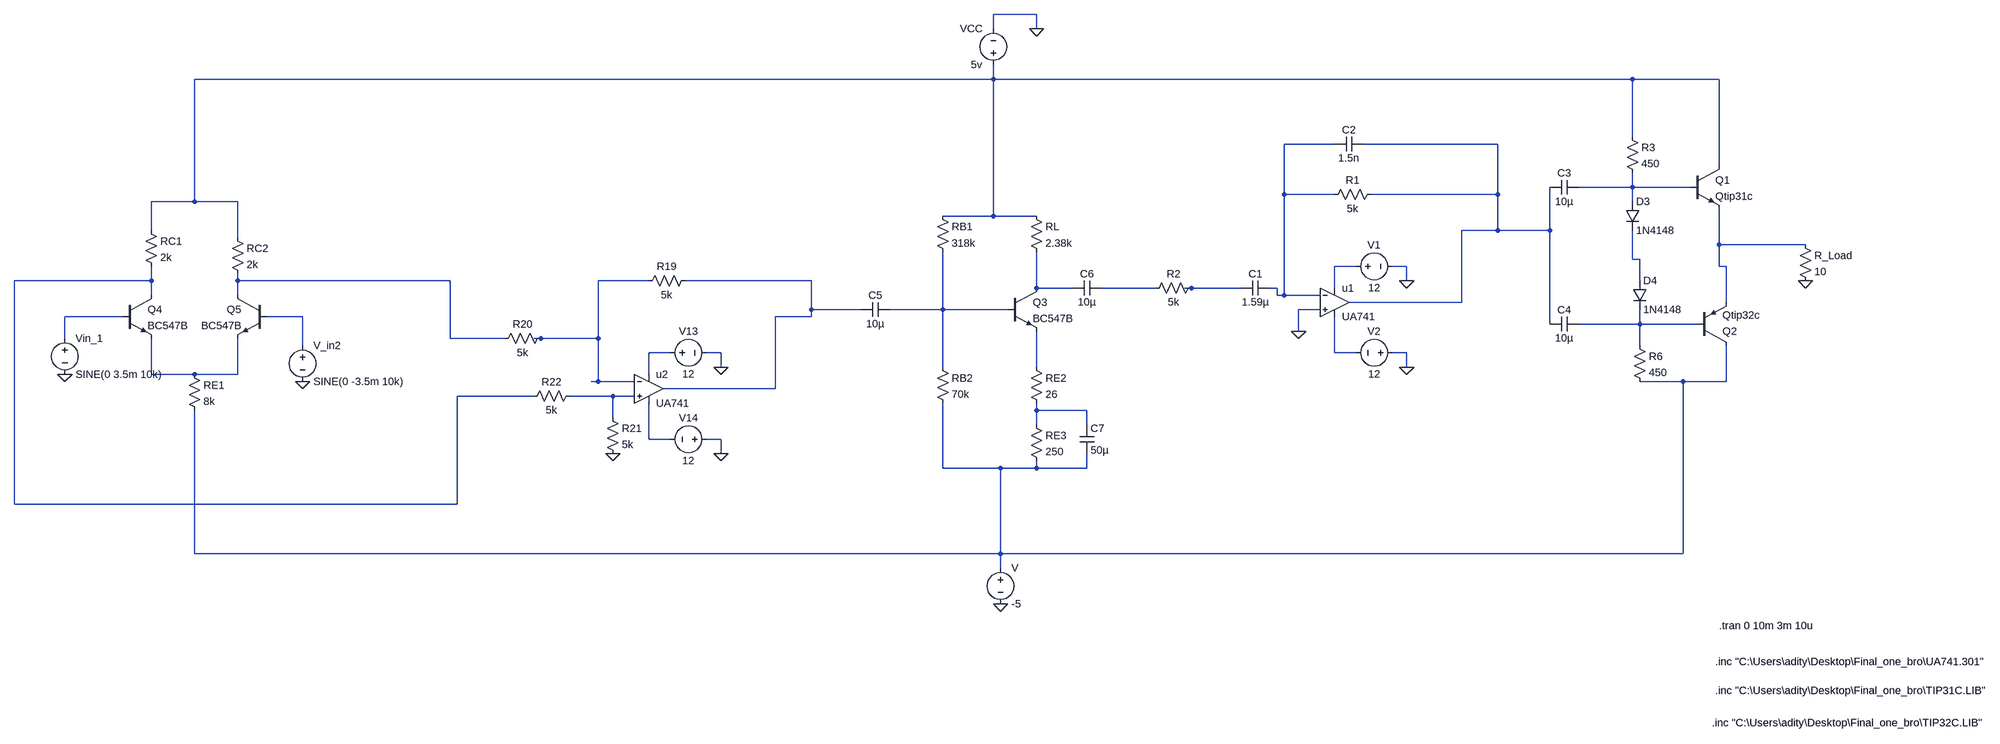
[diagram p0: schematic Project_1_Final.asc]
Project_1_Final.asc, the LTspice schematic file:
Version 4
SHEET 1 3136 1252
WIRE 288 -352 192 -352
WIRE 192 -320 192 -352
WIRE 288 -320 288 -352
WIRE 192 -208 192 -240
WIRE 192 -208 -1872 -208
WIRE 1920 -208 192 -208
WIRE 2112 -208 1920 -208
WIRE 1920 -80 1920 -208
WIRE 1040 -64 928 -64
WIRE 1504 -64 1104 -64
WIRE 2112 -16 2112 -208
WIRE 1920 32 1920 0
WIRE 1920 32 1792 32
WIRE 2048 32 1920 32
WIRE 928 48 928 -64
WIRE 1040 48 928 48
WIRE 1504 48 1504 -64
WIRE 1504 48 1120 48
WIRE -1872 64 -1872 -208
WIRE -1872 64 -1968 64
WIRE -1776 64 -1872 64
WIRE 1920 64 1920 32
WIRE 192 96 192 -208
WIRE 192 96 80 96
WIRE 288 96 192 96
WIRE -1968 128 -1968 64
WIRE 1504 128 1504 48
WIRE 1504 128 1424 128
WIRE 1728 128 1728 32
WIRE 1728 128 1504 128
WIRE -1776 144 -1776 64
WIRE 2112 160 2112 80
WIRE 2304 160 2112 160
WIRE 1920 192 1920 128
WIRE 1936 192 1920 192
WIRE 1088 208 1040 208
WIRE 1200 208 1168 208
WIRE 2112 208 2112 160
WIRE 2128 208 2112 208
WIRE -1968 240 -1968 208
WIRE -1968 240 -2272 240
WIRE -1776 240 -1776 224
WIRE -1248 240 -1776 240
WIRE -768 240 -880 240
WIRE -304 240 -688 240
WIRE 1200 240 1200 208
WIRE 1936 240 1936 192
WIRE 288 256 288 176
WIRE 368 256 288 256
WIRE 624 256 432 256
WIRE 704 256 688 256
WIRE 832 256 704 256
WIRE 912 256 896 256
WIRE 1040 256 1040 208
WIRE -1968 272 -1968 240
WIRE -1776 272 -1776 240
WIRE 912 272 912 256
WIRE 928 272 928 48
WIRE 928 272 912 272
WIRE 1008 272 928 272
WIRE 1424 288 1424 128
WIRE 1424 288 1072 288
WIRE 2128 288 2128 208
WIRE -304 304 -304 240
WIRE -112 304 -304 304
WIRE 80 304 80 176
WIRE 80 304 -48 304
WIRE 224 304 80 304
WIRE 1008 304 960 304
WIRE -2032 320 -2160 320
WIRE -1632 320 -1712 320
WIRE -304 320 -304 304
WIRE -304 320 -384 320
WIRE 1728 336 1728 128
WIRE 1936 336 1936 304
WIRE 1936 336 1792 336
WIRE 2064 336 1936 336
WIRE 960 352 960 304
WIRE -2160 368 -2160 320
WIRE -1248 368 -1248 240
WIRE -1088 368 -1248 368
WIRE -1008 368 -1024 368
WIRE -880 368 -880 240
WIRE -880 368 -1008 368
WIRE -1632 384 -1632 320
WIRE 1936 384 1936 336
WIRE -720 400 -768 400
WIRE -608 400 -640 400
WIRE 1040 400 1040 320
WIRE 1088 400 1040 400
WIRE 1200 400 1168 400
WIRE -608 432 -608 400
WIRE 80 432 80 304
WIRE 288 432 288 352
WIRE 1200 432 1200 400
WIRE -1968 448 -1968 368
WIRE -1872 448 -1968 448
WIRE -1776 448 -1776 368
WIRE -1776 448 -1872 448
WIRE -768 448 -768 400
WIRE -880 464 -880 368
WIRE -880 464 -896 464
WIRE -800 464 -880 464
WIRE 2032 464 1936 464
WIRE 2128 464 2128 384
WIRE 2128 464 2032 464
WIRE -384 480 -384 320
WIRE -384 480 -736 480
WIRE -1024 496 -1232 496
WIRE -848 496 -944 496
WIRE -800 496 -848 496
WIRE 288 528 288 512
WIRE 400 528 288 528
WIRE -848 544 -848 496
WIRE 288 560 288 528
WIRE 400 560 400 528
WIRE -768 592 -768 512
WIRE -720 592 -768 592
WIRE -608 592 -640 592
WIRE -608 624 -608 592
WIRE 80 656 80 512
WIRE 208 656 80 656
WIRE 288 656 288 640
WIRE 288 656 208 656
WIRE 400 656 400 624
WIRE 400 656 288 656
WIRE -2272 736 -2272 240
WIRE -1232 736 -1232 496
WIRE -1232 736 -2272 736
WIRE -1872 848 -1872 528
WIRE 208 848 208 656
WIRE 208 848 -1872 848
WIRE 2032 848 2032 464
WIRE 2032 848 208 848
WIRE 208 880 208 848
FLAG 1200 240 0
FLAG 1200 432 0
FLAG 960 352 0
FLAG 2304 240 0
FLAG 208 960 0
FLAG 288 -320 0
FLAG -2160 448 0
FLAG -1632 464 0
FLAG -608 432 0
FLAG -608 624 0
FLAG -848 624 0
SYMBOL cap 896 240 R90
WINDOW 0 0 32 VBottom 2
WINDOW 3 32 32 VTop 2
SYMATTR InstName C1
SYMATTR Value 1.59µ
SYMBOL cap 1104 -80 R90
WINDOW 0 0 32 VBottom 2
WINDOW 3 32 32 VTop 2
SYMATTR InstName C2
SYMATTR Value 1.5n
SYMBOL res 1136 32 R90
WINDOW 0 0 56 VBottom 2
WINDOW 3 32 56 VTop 2
SYMATTR InstName R1
SYMATTR Value 5k
SYMBOL res 720 240 R90
WINDOW 0 0 56 VBottom 2
WINDOW 3 32 56 VTop 2
SYMATTR InstName R2
SYMATTR Value 5k
SYMBOL OpAmps\\opamp2 1040 224 R0
SYMATTR InstName u1
SYMATTR Value UA741
SYMBOL voltage 1072 208 R270
WINDOW 0 32 56 VTop 2
WINDOW 3 -32 56 VBottom 2
WINDOW 123 0 0 Left 0
WINDOW 39 0 0 Left 0
SYMATTR InstName V1
SYMATTR Value 12
SYMBOL voltage 1184 400 R90
WINDOW 0 -32 56 VBottom 2
WINDOW 3 32 56 VTop 2
WINDOW 123 0 0 Left 0
WINDOW 39 0 0 Left 0
SYMATTR InstName V2
SYMATTR Value 12
SYMBOL res 1904 -96 R0
SYMATTR InstName R3
SYMATTR Value 450
SYMBOL res 1920 368 R0
SYMATTR InstName R6
SYMATTR Value 450
SYMBOL cap 1792 16 R90
WINDOW 0 0 32 VBottom 2
WINDOW 3 32 32 VTop 2
SYMATTR InstName C3
SYMATTR Value 10µ
SYMBOL cap 1792 320 R90
WINDOW 0 0 32 VBottom 2
WINDOW 3 32 32 VTop 2
SYMATTR InstName C4
SYMATTR Value 10µ
SYMBOL npn 2048 -16 R0
SYMATTR InstName Q1
SYMATTR Value Qtip31c
SYMBOL pnp 2064 384 M180
SYMATTR InstName Q2
SYMATTR Value Qtip32c
SYMBOL res 2288 144 R0
SYMATTR InstName R_Load
SYMATTR Value 10
SYMBOL npn 224 256 R0
SYMATTR InstName Q3
SYMATTR Value BC547B
SYMBOL res 64 80 R0
SYMATTR InstName RB1
SYMATTR Value 318k
SYMBOL res 272 80 R0
SYMATTR InstName RL
SYMATTR Value 2.38k
SYMBOL res 272 416 R0
SYMATTR InstName RE2
SYMATTR Value 26
SYMBOL res 64 416 R0
SYMATTR InstName RB2
SYMATTR Value 70k
SYMBOL cap -48 288 R90
WINDOW 0 0 32 VBottom 2
WINDOW 3 32 32 VTop 2
SYMATTR InstName C5
SYMATTR Value 10µ
SYMBOL cap 432 240 R90
WINDOW 0 0 32 VBottom 2
WINDOW 3 32 32 VTop 2
SYMATTR InstName C6
SYMATTR Value 10µ
SYMBOL cap 384 560 R0
SYMATTR InstName C7
SYMATTR Value 50µ
SYMBOL res 272 544 R0
SYMATTR InstName RE3
SYMATTR Value 250
SYMBOL voltage 192 -224 R180
WINDOW 0 24 96 Left 2
WINDOW 3 24 16 Left 2
WINDOW 123 0 0 Left 0
WINDOW 39 0 0 Left 0
SYMATTR InstName VCC
SYMATTR Value 5v
SYMBOL voltage 208 864 R0
WINDOW 123 0 0 Left 0
WINDOW 39 0 0 Left 0
SYMATTR InstName V
SYMATTR Value -5
SYMBOL npn -2032 272 R0
SYMATTR InstName Q4
SYMATTR Value BC547B
SYMBOL npn -1712 272 M0
SYMATTR InstName Q5
SYMATTR Value BC547B
SYMBOL voltage -2160 352 R0
WINDOW 123 0 0 Left 0
WINDOW 39 0 0 Left 0
SYMATTR InstName Vin_1
SYMATTR Value SINE(0 3.5m 10k)
SYMBOL voltage -1632 368 R0
WINDOW 123 0 0 Left 0
WINDOW 39 0 0 Left 0
SYMATTR InstName V_in2
SYMATTR Value SINE(0 -3.5m 10k)
SYMBOL res -1984 112 R0
SYMATTR InstName RC1
SYMATTR Value 2k
SYMBOL res -1792 128 R0
SYMATTR InstName RC2
SYMATTR Value 2k
SYMBOL res -1888 432 R0
SYMATTR InstName RE1
SYMATTR Value 8k
SYMBOL res -672 224 R90
WINDOW 0 0 56 VBottom 2
WINDOW 3 32 56 VTop 2
SYMATTR InstName R19
SYMATTR Value 5k
SYMBOL res -992 352 R90
WINDOW 0 0 56 VBottom 2
WINDOW 3 32 56 VTop 2
SYMATTR InstName R20
SYMATTR Value 5k
SYMBOL OpAmps\\opamp2 -768 416 R0
SYMATTR InstName u2
SYMATTR Value UA741
SYMBOL voltage -736 400 R270
WINDOW 0 32 56 VTop 2
WINDOW 3 -32 56 VBottom 2
WINDOW 123 0 0 Left 0
WINDOW 39 0 0 Left 0
SYMATTR InstName V13
SYMATTR Value 12
SYMBOL voltage -624 592 R90
WINDOW 0 -32 56 VBottom 2
WINDOW 3 32 56 VTop 2
WINDOW 123 0 0 Left 0
WINDOW 39 0 0 Left 0
SYMATTR InstName V14
SYMATTR Value 12
SYMBOL res -864 528 R0
SYMATTR InstName R21
SYMATTR Value 5k
SYMBOL res -928 480 R90
WINDOW 0 0 56 VBottom 2
WINDOW 3 32 56 VTop 2
SYMATTR InstName R22
SYMATTR Value 5k
SYMBOL diode 1904 64 R0
SYMATTR InstName D3
SYMATTR Value 1N4148
SYMBOL diode 1920 240 R0
SYMATTR InstName D4
SYMATTR Value 1N4148
TEXT 2112 1008 Left 2 !.tran 0 10m 3m 10u
TEXT 2104 1088 Left 2 !.inc "C:\\Users\\adity\\Desktop\\Final_one_bro\\UA741.301"
TEXT 2104 1152 Left 2 !.inc "C:\\Users\\adity\\Desktop\\Final_one_bro\\TIP31C.LIB"
TEXT 2096 1224 Left 2 !.inc "C:\\Users\\adity\\Desktop\\Final_one_bro\\TIP32C.LIB"

The netlist it stands for:
* Project_1_Final.asc
C1 N002 N014 1.59µ
C2 N003 N002 1.5n
R1 N003 N002 5k
R2 N014 N013 5k
Xu1 0 N002 N007 N020 N003 UA741  ; pins In+ In- V+ V- OUT
V1 N007 0 12
V2 0 N020 12
R3 N001 N004 450
R6 N018 N023 450
C3 N004 N003 10µ
C4 N018 N003 10µ
Q1 N001 N004 N005 0 Qtip31c
Q2 N023 N018 N005 0 Qtip32c
R_Load N005 0 10
Q3 N012 N015 N021 0 BC547B
RB1 N001 N015 318k
RL N001 N012 2.38k
RE2 N021 N025 26
RB2 N015 N023 70k
C5 N015 N011 10µ
C6 N013 N012 10µ
C7 N025 N023 50µ
RE3 N025 N023 250
VCC N001 0 5v
V N023 0 -5
Q4 N008 N016 N022 0 BC547B
Q5 N009 N017 N022 0 BC547B
Vin_1 N016 0 SINE(0 3.5m 10k)
V_in2 N017 0 SINE(0 -3.5m 10k)
RC1 N001 N008 2k
RC2 N001 N009 2k
RE1 N022 N023 8k
R19 N011 N010 5k
R20 N010 N009 5k
Xu2 N024 N010 N019 N026 N011 UA741  ; pins In+ In- V+ V- OUT
V13 N019 0 12
V14 0 N026 12
R21 N024 0 5k
R22 N024 N008 5k
D3 N004 N006 1N4148
D4 N006 N018 1N4148
.model D D
.lib standard.dio
.model NPN NPN
.model PNP PNP
.lib standard.bjt
.tran 0 10m 3m 10u
.inc "C:\Users\adity\Desktop\Final_one_bro\UA741.301"
.inc "C:\Users\adity\Desktop\Final_one_bro\TIP31C.LIB"
.inc "C:\Users\adity\Desktop\Final_one_bro\TIP32C.LIB"
.backanno
.end